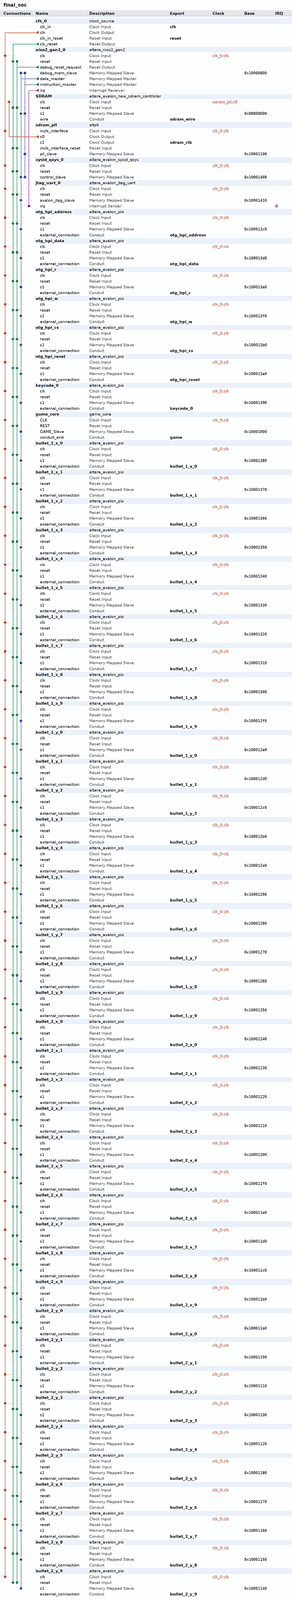
[diagram p0: system contents, whole]
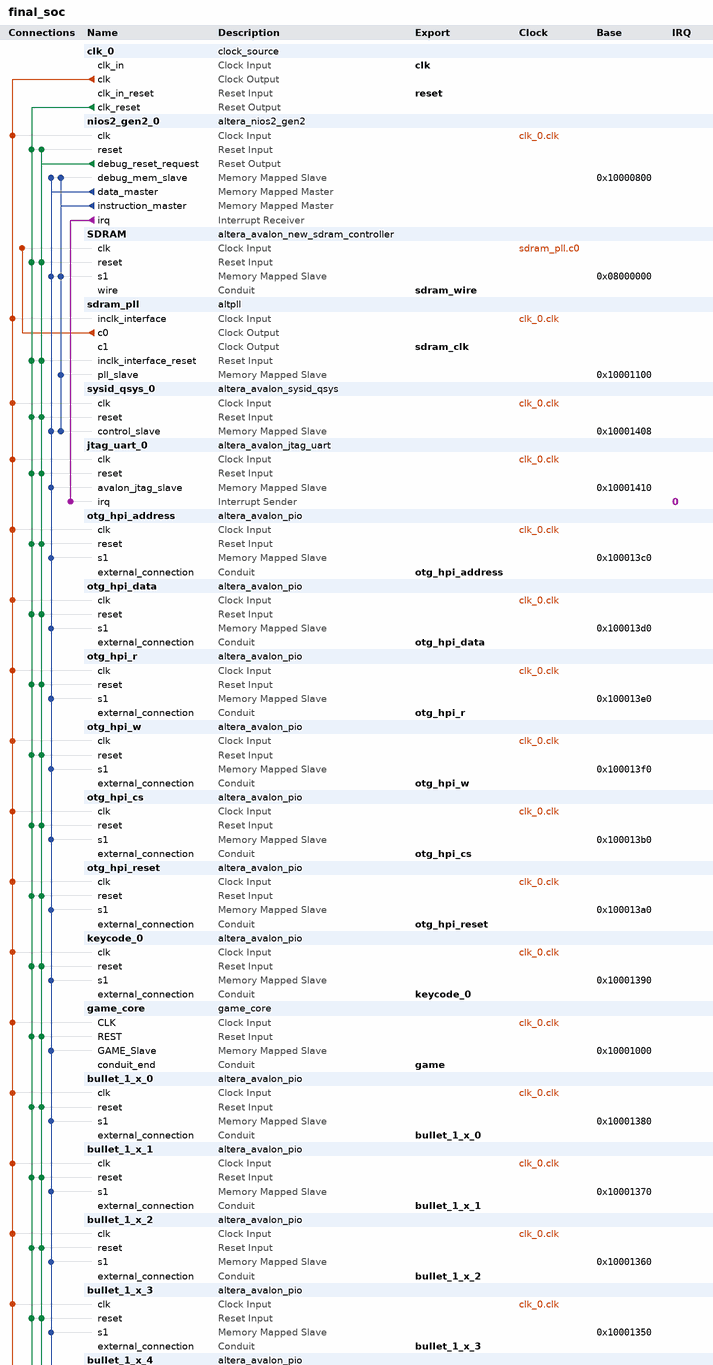
[diagram p1: system contents, upper part]
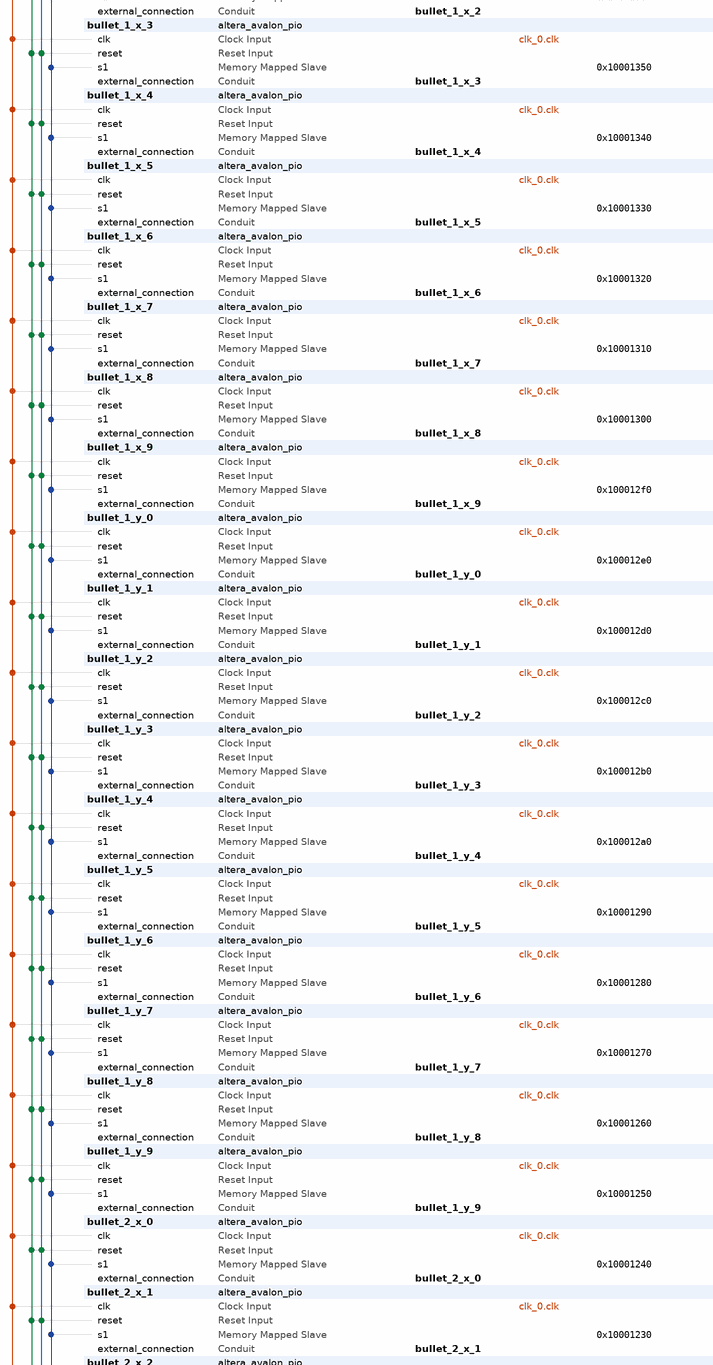
[diagram p2: system contents, middle part]
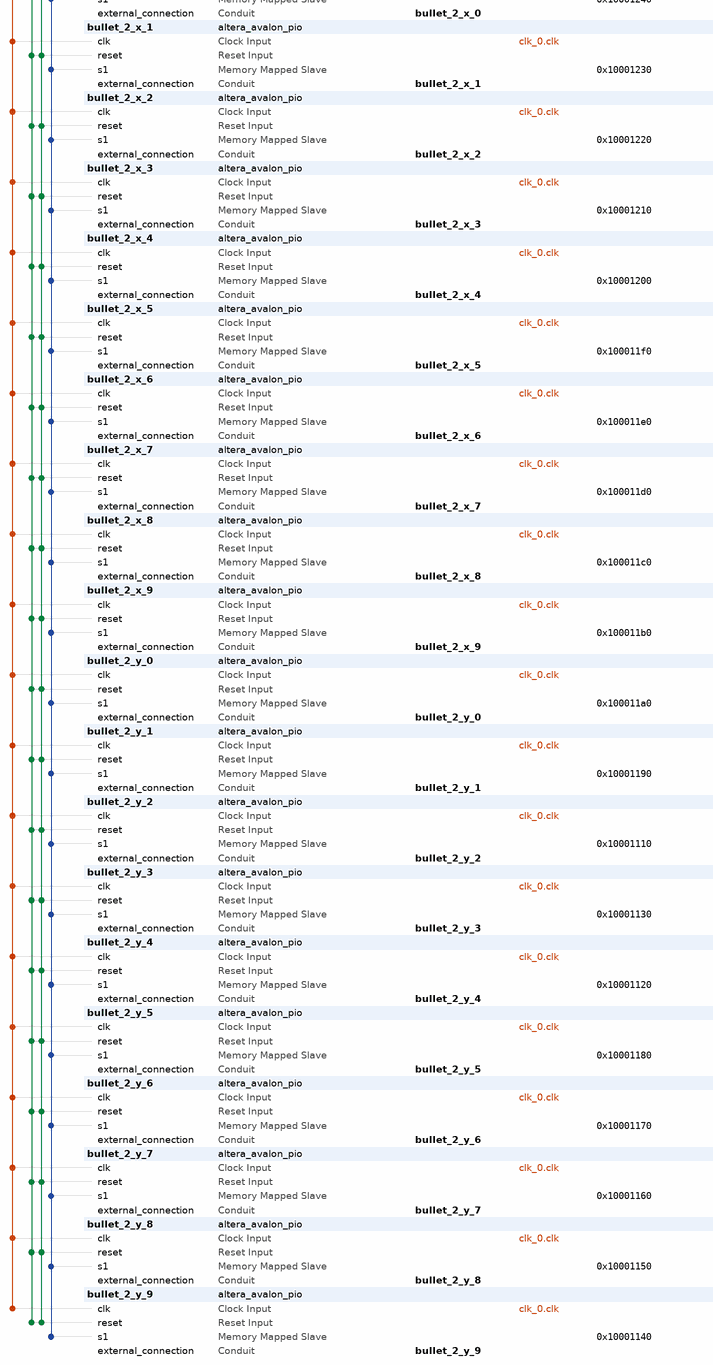
[diagram p3: system contents, lower part]
# Platform Designer (Qsys) system final_soc, Cyclone IV E EP4CE115F29C7
# Parameters at their usual value, and those the tool derives, are not listed.
package require -exact qsys 18.0
create_system final_soc
set_project_property DEVICE_FAMILY {Cyclone IV E}
set_project_property DEVICE EP4CE115F29C7

add_instance clk_0 clock_source 18.0
set_instance_parameter_value clk_0 clockFrequency 50000000

add_instance nios2_gen2_0 altera_nios2_gen2 18.0
set_instance_parameter_value nios2_gen2_0 dcache_size 2048
set_instance_parameter_value nios2_gen2_0 exceptionSlave SDRAM.s1
set_instance_parameter_value nios2_gen2_0 icache_size 4096
set_instance_parameter_value nios2_gen2_0 impl Tiny
set_instance_parameter_value nios2_gen2_0 resetSlave SDRAM.s1

add_instance SDRAM altera_avalon_new_sdram_controller 18.0
set_instance_parameter_value SDRAM TAC 5.5
set_instance_parameter_value SDRAM TRCD 20.0
set_instance_parameter_value SDRAM TRP 20.0
set_instance_parameter_value SDRAM casLatency 3
set_instance_parameter_value SDRAM columnWidth 10
set_instance_parameter_value SDRAM dataWidth 32
set_instance_parameter_value SDRAM generateSimulationModel false
set_instance_parameter_value SDRAM model single_Micron_MT48LC4M32B2_7_chip
set_instance_parameter_value SDRAM numberOfBanks 4
set_instance_parameter_value SDRAM numberOfChipSelects 1
set_instance_parameter_value SDRAM powerUpDelay 100.0
set_instance_parameter_value SDRAM refreshPeriod 7.8125
set_instance_parameter_value SDRAM rowWidth 13

add_instance sdram_pll altpll 18.0
set_instance_parameter_value sdram_pll CLK0_DIVIDE_BY 1
set_instance_parameter_value sdram_pll CLK0_MULTIPLY_BY 1
set_instance_parameter_value sdram_pll CLK1_DIVIDE_BY 1
set_instance_parameter_value sdram_pll CLK1_DUTY_CYCLE 50
set_instance_parameter_value sdram_pll CLK1_MULTIPLY_BY 1
set_instance_parameter_value sdram_pll CLK1_PHASE_SHIFT -3000
set_instance_parameter_value sdram_pll INCLK0_INPUT_FREQUENCY 20000
set_instance_parameter_value sdram_pll PORT_ARESET PORT_UNUSED
set_instance_parameter_value sdram_pll PORT_LOCKED PORT_UNUSED
set_instance_parameter_value sdram_pll PORT_clk1 PORT_USED
set_instance_parameter_value sdram_pll PORT_clk2 PORT_UNUSED
set_instance_parameter_value sdram_pll PORT_clk3 PORT_UNUSED

add_instance sysid_qsys_0 altera_avalon_sysid_qsys 18.0
set_instance_parameter_value sysid_qsys_0 id 0

add_instance jtag_uart_0 altera_avalon_jtag_uart 18.0
set_instance_parameter_value jtag_uart_0 simInteractiveOptions NO_INTERACTIVE_WINDOWS

add_instance otg_hpi_address altera_avalon_pio 18.0
set_instance_parameter_value otg_hpi_address direction Output
set_instance_parameter_value otg_hpi_address width 2

add_instance otg_hpi_data altera_avalon_pio 18.0
set_instance_parameter_value otg_hpi_data direction InOut
set_instance_parameter_value otg_hpi_data width 16

add_instance otg_hpi_r altera_avalon_pio 18.0
set_instance_parameter_value otg_hpi_r direction Output
set_instance_parameter_value otg_hpi_r width 1

add_instance otg_hpi_w altera_avalon_pio 18.0
set_instance_parameter_value otg_hpi_w direction Output
set_instance_parameter_value otg_hpi_w width 1

add_instance otg_hpi_cs altera_avalon_pio 18.0
set_instance_parameter_value otg_hpi_cs direction Output
set_instance_parameter_value otg_hpi_cs width 1

add_instance otg_hpi_reset altera_avalon_pio 18.0
set_instance_parameter_value otg_hpi_reset direction Output
set_instance_parameter_value otg_hpi_reset width 1

add_instance keycode_0 altera_avalon_pio 18.0
set_instance_parameter_value keycode_0 direction Output
set_instance_parameter_value keycode_0 width 8

add_instance game_core game_core 1.0

add_instance bullet_1_x_0 altera_avalon_pio 18.0
set_instance_parameter_value bullet_1_x_0 direction Output
set_instance_parameter_value bullet_1_x_0 width 10

add_instance bullet_1_x_1 altera_avalon_pio 18.0
set_instance_parameter_value bullet_1_x_1 direction Output
set_instance_parameter_value bullet_1_x_1 width 10

add_instance bullet_1_x_2 altera_avalon_pio 18.0
set_instance_parameter_value bullet_1_x_2 direction Output
set_instance_parameter_value bullet_1_x_2 width 10

add_instance bullet_1_x_3 altera_avalon_pio 18.0
set_instance_parameter_value bullet_1_x_3 direction Output
set_instance_parameter_value bullet_1_x_3 width 10

add_instance bullet_1_x_4 altera_avalon_pio 18.0
set_instance_parameter_value bullet_1_x_4 direction Output
set_instance_parameter_value bullet_1_x_4 width 10

add_instance bullet_1_x_5 altera_avalon_pio 18.0
set_instance_parameter_value bullet_1_x_5 direction Output
set_instance_parameter_value bullet_1_x_5 width 10

add_instance bullet_1_x_6 altera_avalon_pio 18.0
set_instance_parameter_value bullet_1_x_6 direction Output
set_instance_parameter_value bullet_1_x_6 width 10

add_instance bullet_1_x_7 altera_avalon_pio 18.0
set_instance_parameter_value bullet_1_x_7 direction Output
set_instance_parameter_value bullet_1_x_7 width 10

add_instance bullet_1_x_8 altera_avalon_pio 18.0
set_instance_parameter_value bullet_1_x_8 direction Output
set_instance_parameter_value bullet_1_x_8 width 10

add_instance bullet_1_x_9 altera_avalon_pio 18.0
set_instance_parameter_value bullet_1_x_9 direction Output
set_instance_parameter_value bullet_1_x_9 width 10

add_instance bullet_1_y_0 altera_avalon_pio 18.0
set_instance_parameter_value bullet_1_y_0 direction Output
set_instance_parameter_value bullet_1_y_0 width 10

add_instance bullet_1_y_1 altera_avalon_pio 18.0
set_instance_parameter_value bullet_1_y_1 direction Output
set_instance_parameter_value bullet_1_y_1 width 10

add_instance bullet_1_y_2 altera_avalon_pio 18.0
set_instance_parameter_value bullet_1_y_2 direction Output
set_instance_parameter_value bullet_1_y_2 width 10

add_instance bullet_1_y_3 altera_avalon_pio 18.0
set_instance_parameter_value bullet_1_y_3 direction Output
set_instance_parameter_value bullet_1_y_3 width 10

add_instance bullet_1_y_4 altera_avalon_pio 18.0
set_instance_parameter_value bullet_1_y_4 direction Output
set_instance_parameter_value bullet_1_y_4 width 10

add_instance bullet_1_y_5 altera_avalon_pio 18.0
set_instance_parameter_value bullet_1_y_5 direction Output
set_instance_parameter_value bullet_1_y_5 width 10

add_instance bullet_1_y_6 altera_avalon_pio 18.0
set_instance_parameter_value bullet_1_y_6 direction Output
set_instance_parameter_value bullet_1_y_6 width 10

add_instance bullet_1_y_7 altera_avalon_pio 18.0
set_instance_parameter_value bullet_1_y_7 direction Output
set_instance_parameter_value bullet_1_y_7 width 10

add_instance bullet_1_y_8 altera_avalon_pio 18.0
set_instance_parameter_value bullet_1_y_8 direction Output
set_instance_parameter_value bullet_1_y_8 width 10

add_instance bullet_1_y_9 altera_avalon_pio 18.0
set_instance_parameter_value bullet_1_y_9 direction Output
set_instance_parameter_value bullet_1_y_9 width 10

add_instance bullet_2_x_0 altera_avalon_pio 18.0
set_instance_parameter_value bullet_2_x_0 direction Output
set_instance_parameter_value bullet_2_x_0 width 10

add_instance bullet_2_x_1 altera_avalon_pio 18.0
set_instance_parameter_value bullet_2_x_1 direction Output
set_instance_parameter_value bullet_2_x_1 width 10

add_instance bullet_2_x_2 altera_avalon_pio 18.0
set_instance_parameter_value bullet_2_x_2 direction Output
set_instance_parameter_value bullet_2_x_2 width 10

add_instance bullet_2_x_3 altera_avalon_pio 18.0
set_instance_parameter_value bullet_2_x_3 direction Output
set_instance_parameter_value bullet_2_x_3 width 10

add_instance bullet_2_x_4 altera_avalon_pio 18.0
set_instance_parameter_value bullet_2_x_4 direction Output
set_instance_parameter_value bullet_2_x_4 width 10

add_instance bullet_2_x_5 altera_avalon_pio 18.0
set_instance_parameter_value bullet_2_x_5 direction Output
set_instance_parameter_value bullet_2_x_5 width 10

add_instance bullet_2_x_6 altera_avalon_pio 18.0
set_instance_parameter_value bullet_2_x_6 direction Output
set_instance_parameter_value bullet_2_x_6 width 10

add_instance bullet_2_x_7 altera_avalon_pio 18.0
set_instance_parameter_value bullet_2_x_7 direction Output
set_instance_parameter_value bullet_2_x_7 width 10

add_instance bullet_2_x_8 altera_avalon_pio 18.0
set_instance_parameter_value bullet_2_x_8 direction Output
set_instance_parameter_value bullet_2_x_8 width 10

add_instance bullet_2_x_9 altera_avalon_pio 18.0
set_instance_parameter_value bullet_2_x_9 direction Output
set_instance_parameter_value bullet_2_x_9 width 10

add_instance bullet_2_y_0 altera_avalon_pio 18.0
set_instance_parameter_value bullet_2_y_0 direction Output
set_instance_parameter_value bullet_2_y_0 width 10

add_instance bullet_2_y_1 altera_avalon_pio 18.0
set_instance_parameter_value bullet_2_y_1 direction Output
set_instance_parameter_value bullet_2_y_1 width 10

add_instance bullet_2_y_2 altera_avalon_pio 18.0
set_instance_parameter_value bullet_2_y_2 direction Output
set_instance_parameter_value bullet_2_y_2 width 10

add_instance bullet_2_y_3 altera_avalon_pio 18.0
set_instance_parameter_value bullet_2_y_3 direction Output
set_instance_parameter_value bullet_2_y_3 width 10

add_instance bullet_2_y_4 altera_avalon_pio 18.0
set_instance_parameter_value bullet_2_y_4 direction Output
set_instance_parameter_value bullet_2_y_4 width 10

add_instance bullet_2_y_5 altera_avalon_pio 18.0
set_instance_parameter_value bullet_2_y_5 direction Output
set_instance_parameter_value bullet_2_y_5 width 10

add_instance bullet_2_y_6 altera_avalon_pio 18.0
set_instance_parameter_value bullet_2_y_6 direction Output
set_instance_parameter_value bullet_2_y_6 width 10

add_instance bullet_2_y_7 altera_avalon_pio 18.0
set_instance_parameter_value bullet_2_y_7 direction Output
set_instance_parameter_value bullet_2_y_7 width 10

add_instance bullet_2_y_8 altera_avalon_pio 18.0
set_instance_parameter_value bullet_2_y_8 direction Output
set_instance_parameter_value bullet_2_y_8 width 10

add_instance bullet_2_y_9 altera_avalon_pio 18.0
set_instance_parameter_value bullet_2_y_9 direction Output
set_instance_parameter_value bullet_2_y_9 width 10

# connections
add_connection clk_0.clk bullet_1_x_0.clk clock
add_connection clk_0.clk bullet_1_x_1.clk clock
add_connection clk_0.clk bullet_1_x_2.clk clock
add_connection clk_0.clk bullet_1_x_3.clk clock
add_connection clk_0.clk bullet_1_x_4.clk clock
add_connection clk_0.clk bullet_1_x_5.clk clock
add_connection clk_0.clk bullet_1_x_6.clk clock
add_connection clk_0.clk bullet_1_x_7.clk clock
add_connection clk_0.clk bullet_1_x_8.clk clock
add_connection clk_0.clk bullet_1_x_9.clk clock
add_connection clk_0.clk bullet_1_y_0.clk clock
add_connection clk_0.clk bullet_1_y_1.clk clock
add_connection clk_0.clk bullet_1_y_2.clk clock
add_connection clk_0.clk bullet_1_y_3.clk clock
add_connection clk_0.clk bullet_1_y_4.clk clock
add_connection clk_0.clk bullet_1_y_5.clk clock
add_connection clk_0.clk bullet_1_y_6.clk clock
add_connection clk_0.clk bullet_1_y_7.clk clock
add_connection clk_0.clk bullet_1_y_8.clk clock
add_connection clk_0.clk bullet_1_y_9.clk clock
add_connection clk_0.clk bullet_2_x_0.clk clock
add_connection clk_0.clk bullet_2_x_1.clk clock
add_connection clk_0.clk bullet_2_x_2.clk clock
add_connection clk_0.clk bullet_2_x_3.clk clock
add_connection clk_0.clk bullet_2_x_4.clk clock
add_connection clk_0.clk bullet_2_x_5.clk clock
add_connection clk_0.clk bullet_2_x_6.clk clock
add_connection clk_0.clk bullet_2_x_7.clk clock
add_connection clk_0.clk bullet_2_x_8.clk clock
add_connection clk_0.clk bullet_2_x_9.clk clock
add_connection clk_0.clk bullet_2_y_0.clk clock
add_connection clk_0.clk bullet_2_y_1.clk clock
add_connection clk_0.clk bullet_2_y_2.clk clock
add_connection clk_0.clk bullet_2_y_3.clk clock
add_connection clk_0.clk bullet_2_y_4.clk clock
add_connection clk_0.clk bullet_2_y_5.clk clock
add_connection clk_0.clk bullet_2_y_6.clk clock
add_connection clk_0.clk bullet_2_y_7.clk clock
add_connection clk_0.clk bullet_2_y_8.clk clock
add_connection clk_0.clk bullet_2_y_9.clk clock
add_connection clk_0.clk game_core.CLK clock
add_connection clk_0.clk jtag_uart_0.clk clock
add_connection clk_0.clk keycode_0.clk clock
add_connection clk_0.clk nios2_gen2_0.clk clock
add_connection clk_0.clk otg_hpi_address.clk clock
add_connection clk_0.clk otg_hpi_cs.clk clock
add_connection clk_0.clk otg_hpi_data.clk clock
add_connection clk_0.clk otg_hpi_r.clk clock
add_connection clk_0.clk otg_hpi_reset.clk clock
add_connection clk_0.clk otg_hpi_w.clk clock
add_connection clk_0.clk sdram_pll.inclk_interface clock
add_connection clk_0.clk sysid_qsys_0.clk clock
add_connection sdram_pll.c0 SDRAM.clk clock
add_connection clk_0.clk_reset bullet_1_x_0.reset reset
add_connection clk_0.clk_reset bullet_1_x_1.reset reset
add_connection clk_0.clk_reset bullet_1_x_2.reset reset
add_connection clk_0.clk_reset bullet_1_x_3.reset reset
add_connection clk_0.clk_reset bullet_1_x_4.reset reset
add_connection clk_0.clk_reset bullet_1_x_5.reset reset
add_connection clk_0.clk_reset bullet_1_x_6.reset reset
add_connection clk_0.clk_reset bullet_1_x_7.reset reset
add_connection clk_0.clk_reset bullet_1_x_8.reset reset
add_connection clk_0.clk_reset bullet_1_x_9.reset reset
add_connection clk_0.clk_reset bullet_1_y_0.reset reset
add_connection clk_0.clk_reset bullet_1_y_1.reset reset
add_connection clk_0.clk_reset bullet_1_y_2.reset reset
add_connection clk_0.clk_reset bullet_1_y_3.reset reset
add_connection clk_0.clk_reset bullet_1_y_4.reset reset
add_connection clk_0.clk_reset bullet_1_y_5.reset reset
add_connection clk_0.clk_reset bullet_1_y_6.reset reset
add_connection clk_0.clk_reset bullet_1_y_7.reset reset
add_connection clk_0.clk_reset bullet_1_y_8.reset reset
add_connection clk_0.clk_reset bullet_1_y_9.reset reset
add_connection clk_0.clk_reset bullet_2_x_0.reset reset
add_connection clk_0.clk_reset bullet_2_x_1.reset reset
add_connection clk_0.clk_reset bullet_2_x_2.reset reset
add_connection clk_0.clk_reset bullet_2_x_3.reset reset
add_connection clk_0.clk_reset bullet_2_x_4.reset reset
add_connection clk_0.clk_reset bullet_2_x_5.reset reset
add_connection clk_0.clk_reset bullet_2_x_6.reset reset
add_connection clk_0.clk_reset bullet_2_x_7.reset reset
add_connection clk_0.clk_reset bullet_2_x_8.reset reset
add_connection clk_0.clk_reset bullet_2_x_9.reset reset
add_connection clk_0.clk_reset bullet_2_y_0.reset reset
add_connection clk_0.clk_reset bullet_2_y_1.reset reset
add_connection clk_0.clk_reset bullet_2_y_2.reset reset
add_connection clk_0.clk_reset bullet_2_y_3.reset reset
add_connection clk_0.clk_reset bullet_2_y_4.reset reset
add_connection clk_0.clk_reset bullet_2_y_5.reset reset
add_connection clk_0.clk_reset bullet_2_y_6.reset reset
add_connection clk_0.clk_reset bullet_2_y_7.reset reset
add_connection clk_0.clk_reset bullet_2_y_8.reset reset
add_connection clk_0.clk_reset bullet_2_y_9.reset reset
add_connection clk_0.clk_reset game_core.REST reset
add_connection clk_0.clk_reset jtag_uart_0.reset reset
add_connection clk_0.clk_reset keycode_0.reset reset
add_connection clk_0.clk_reset nios2_gen2_0.reset reset
add_connection clk_0.clk_reset otg_hpi_address.reset reset
add_connection clk_0.clk_reset otg_hpi_cs.reset reset
add_connection clk_0.clk_reset otg_hpi_data.reset reset
add_connection clk_0.clk_reset otg_hpi_r.reset reset
add_connection clk_0.clk_reset otg_hpi_reset.reset reset
add_connection clk_0.clk_reset otg_hpi_w.reset reset
add_connection clk_0.clk_reset SDRAM.reset reset
add_connection clk_0.clk_reset sdram_pll.inclk_interface_reset reset
add_connection clk_0.clk_reset sysid_qsys_0.reset reset
add_connection nios2_gen2_0.debug_reset_request bullet_1_x_0.reset reset
add_connection nios2_gen2_0.debug_reset_request bullet_1_x_1.reset reset
add_connection nios2_gen2_0.debug_reset_request bullet_1_x_2.reset reset
add_connection nios2_gen2_0.debug_reset_request bullet_1_x_3.reset reset
add_connection nios2_gen2_0.debug_reset_request bullet_1_x_4.reset reset
add_connection nios2_gen2_0.debug_reset_request bullet_1_x_5.reset reset
add_connection nios2_gen2_0.debug_reset_request bullet_1_x_6.reset reset
add_connection nios2_gen2_0.debug_reset_request bullet_1_x_7.reset reset
add_connection nios2_gen2_0.debug_reset_request bullet_1_x_8.reset reset
add_connection nios2_gen2_0.debug_reset_request bullet_1_x_9.reset reset
add_connection nios2_gen2_0.debug_reset_request bullet_1_y_0.reset reset
add_connection nios2_gen2_0.debug_reset_request bullet_1_y_1.reset reset
add_connection nios2_gen2_0.debug_reset_request bullet_1_y_2.reset reset
add_connection nios2_gen2_0.debug_reset_request bullet_1_y_3.reset reset
add_connection nios2_gen2_0.debug_reset_request bullet_1_y_4.reset reset
add_connection nios2_gen2_0.debug_reset_request bullet_1_y_5.reset reset
add_connection nios2_gen2_0.debug_reset_request bullet_1_y_6.reset reset
add_connection nios2_gen2_0.debug_reset_request bullet_1_y_7.reset reset
add_connection nios2_gen2_0.debug_reset_request bullet_1_y_8.reset reset
add_connection nios2_gen2_0.debug_reset_request bullet_1_y_9.reset reset
add_connection nios2_gen2_0.debug_reset_request bullet_2_x_0.reset reset
add_connection nios2_gen2_0.debug_reset_request bullet_2_x_1.reset reset
add_connection nios2_gen2_0.debug_reset_request bullet_2_x_2.reset reset
add_connection nios2_gen2_0.debug_reset_request bullet_2_x_3.reset reset
add_connection nios2_gen2_0.debug_reset_request bullet_2_x_4.reset reset
add_connection nios2_gen2_0.debug_reset_request bullet_2_x_5.reset reset
add_connection nios2_gen2_0.debug_reset_request bullet_2_x_6.reset reset
add_connection nios2_gen2_0.debug_reset_request bullet_2_x_7.reset reset
add_connection nios2_gen2_0.debug_reset_request bullet_2_x_8.reset reset
add_connection nios2_gen2_0.debug_reset_request bullet_2_x_9.reset reset
add_connection nios2_gen2_0.debug_reset_request bullet_2_y_0.reset reset
add_connection nios2_gen2_0.debug_reset_request bullet_2_y_1.reset reset
add_connection nios2_gen2_0.debug_reset_request bullet_2_y_2.reset reset
add_connection nios2_gen2_0.debug_reset_request bullet_2_y_3.reset reset
add_connection nios2_gen2_0.debug_reset_request bullet_2_y_4.reset reset
add_connection nios2_gen2_0.debug_reset_request bullet_2_y_5.reset reset
add_connection nios2_gen2_0.debug_reset_request bullet_2_y_6.reset reset
add_connection nios2_gen2_0.debug_reset_request bullet_2_y_7.reset reset
add_connection nios2_gen2_0.debug_reset_request bullet_2_y_8.reset reset
add_connection nios2_gen2_0.debug_reset_request bullet_2_y_9.reset reset
add_connection nios2_gen2_0.debug_reset_request game_core.REST reset
add_connection nios2_gen2_0.debug_reset_request jtag_uart_0.reset reset
add_connection nios2_gen2_0.debug_reset_request keycode_0.reset reset
add_connection nios2_gen2_0.debug_reset_request nios2_gen2_0.reset reset
add_connection nios2_gen2_0.debug_reset_request otg_hpi_address.reset reset
add_connection nios2_gen2_0.debug_reset_request otg_hpi_cs.reset reset
add_connection nios2_gen2_0.debug_reset_request otg_hpi_data.reset reset
add_connection nios2_gen2_0.debug_reset_request otg_hpi_r.reset reset
add_connection nios2_gen2_0.debug_reset_request otg_hpi_reset.reset reset
add_connection nios2_gen2_0.debug_reset_request otg_hpi_w.reset reset
add_connection nios2_gen2_0.debug_reset_request SDRAM.reset reset
add_connection nios2_gen2_0.debug_reset_request sdram_pll.inclk_interface_reset reset
add_connection nios2_gen2_0.debug_reset_request sysid_qsys_0.reset reset
add_connection nios2_gen2_0.data_master bullet_1_x_0.s1 avalon
set_connection_parameter_value nios2_gen2_0.data_master/bullet_1_x_0.s1 baseAddress 0x10001380
add_connection nios2_gen2_0.data_master bullet_1_x_1.s1 avalon
set_connection_parameter_value nios2_gen2_0.data_master/bullet_1_x_1.s1 baseAddress 0x10001370
add_connection nios2_gen2_0.data_master bullet_1_x_2.s1 avalon
set_connection_parameter_value nios2_gen2_0.data_master/bullet_1_x_2.s1 baseAddress 0x10001360
add_connection nios2_gen2_0.data_master bullet_1_x_3.s1 avalon
set_connection_parameter_value nios2_gen2_0.data_master/bullet_1_x_3.s1 baseAddress 0x10001350
add_connection nios2_gen2_0.data_master bullet_1_x_4.s1 avalon
set_connection_parameter_value nios2_gen2_0.data_master/bullet_1_x_4.s1 baseAddress 0x10001340
add_connection nios2_gen2_0.data_master bullet_1_x_5.s1 avalon
set_connection_parameter_value nios2_gen2_0.data_master/bullet_1_x_5.s1 baseAddress 0x10001330
add_connection nios2_gen2_0.data_master bullet_1_x_6.s1 avalon
set_connection_parameter_value nios2_gen2_0.data_master/bullet_1_x_6.s1 baseAddress 0x10001320
add_connection nios2_gen2_0.data_master bullet_1_x_7.s1 avalon
set_connection_parameter_value nios2_gen2_0.data_master/bullet_1_x_7.s1 baseAddress 0x10001310
add_connection nios2_gen2_0.data_master bullet_1_x_8.s1 avalon
set_connection_parameter_value nios2_gen2_0.data_master/bullet_1_x_8.s1 baseAddress 0x10001300
add_connection nios2_gen2_0.data_master bullet_1_x_9.s1 avalon
set_connection_parameter_value nios2_gen2_0.data_master/bullet_1_x_9.s1 baseAddress 0x100012f0
add_connection nios2_gen2_0.data_master bullet_1_y_0.s1 avalon
set_connection_parameter_value nios2_gen2_0.data_master/bullet_1_y_0.s1 baseAddress 0x100012e0
add_connection nios2_gen2_0.data_master bullet_1_y_1.s1 avalon
set_connection_parameter_value nios2_gen2_0.data_master/bullet_1_y_1.s1 baseAddress 0x100012d0
add_connection nios2_gen2_0.data_master bullet_1_y_2.s1 avalon
set_connection_parameter_value nios2_gen2_0.data_master/bullet_1_y_2.s1 baseAddress 0x100012c0
add_connection nios2_gen2_0.data_master bullet_1_y_3.s1 avalon
set_connection_parameter_value nios2_gen2_0.data_master/bullet_1_y_3.s1 baseAddress 0x100012b0
add_connection nios2_gen2_0.data_master bullet_1_y_4.s1 avalon
set_connection_parameter_value nios2_gen2_0.data_master/bullet_1_y_4.s1 baseAddress 0x100012a0
add_connection nios2_gen2_0.data_master bullet_1_y_5.s1 avalon
set_connection_parameter_value nios2_gen2_0.data_master/bullet_1_y_5.s1 baseAddress 0x10001290
add_connection nios2_gen2_0.data_master bullet_1_y_6.s1 avalon
set_connection_parameter_value nios2_gen2_0.data_master/bullet_1_y_6.s1 baseAddress 0x10001280
add_connection nios2_gen2_0.data_master bullet_1_y_7.s1 avalon
set_connection_parameter_value nios2_gen2_0.data_master/bullet_1_y_7.s1 baseAddress 0x10001270
add_connection nios2_gen2_0.data_master bullet_1_y_8.s1 avalon
set_connection_parameter_value nios2_gen2_0.data_master/bullet_1_y_8.s1 baseAddress 0x10001260
add_connection nios2_gen2_0.data_master bullet_1_y_9.s1 avalon
set_connection_parameter_value nios2_gen2_0.data_master/bullet_1_y_9.s1 baseAddress 0x10001250
add_connection nios2_gen2_0.data_master bullet_2_x_0.s1 avalon
set_connection_parameter_value nios2_gen2_0.data_master/bullet_2_x_0.s1 baseAddress 0x10001240
add_connection nios2_gen2_0.data_master bullet_2_x_1.s1 avalon
set_connection_parameter_value nios2_gen2_0.data_master/bullet_2_x_1.s1 baseAddress 0x10001230
add_connection nios2_gen2_0.data_master bullet_2_x_2.s1 avalon
set_connection_parameter_value nios2_gen2_0.data_master/bullet_2_x_2.s1 baseAddress 0x10001220
add_connection nios2_gen2_0.data_master bullet_2_x_3.s1 avalon
set_connection_parameter_value nios2_gen2_0.data_master/bullet_2_x_3.s1 baseAddress 0x10001210
add_connection nios2_gen2_0.data_master bullet_2_x_4.s1 avalon
set_connection_parameter_value nios2_gen2_0.data_master/bullet_2_x_4.s1 baseAddress 0x10001200
add_connection nios2_gen2_0.data_master bullet_2_x_5.s1 avalon
set_connection_parameter_value nios2_gen2_0.data_master/bullet_2_x_5.s1 baseAddress 0x100011f0
add_connection nios2_gen2_0.data_master bullet_2_x_6.s1 avalon
set_connection_parameter_value nios2_gen2_0.data_master/bullet_2_x_6.s1 baseAddress 0x100011e0
add_connection nios2_gen2_0.data_master bullet_2_x_7.s1 avalon
set_connection_parameter_value nios2_gen2_0.data_master/bullet_2_x_7.s1 baseAddress 0x100011d0
add_connection nios2_gen2_0.data_master bullet_2_x_8.s1 avalon
set_connection_parameter_value nios2_gen2_0.data_master/bullet_2_x_8.s1 baseAddress 0x100011c0
add_connection nios2_gen2_0.data_master bullet_2_x_9.s1 avalon
set_connection_parameter_value nios2_gen2_0.data_master/bullet_2_x_9.s1 baseAddress 0x100011b0
add_connection nios2_gen2_0.data_master bullet_2_y_0.s1 avalon
set_connection_parameter_value nios2_gen2_0.data_master/bullet_2_y_0.s1 baseAddress 0x100011a0
add_connection nios2_gen2_0.data_master bullet_2_y_1.s1 avalon
set_connection_parameter_value nios2_gen2_0.data_master/bullet_2_y_1.s1 baseAddress 0x10001190
add_connection nios2_gen2_0.data_master bullet_2_y_2.s1 avalon
set_connection_parameter_value nios2_gen2_0.data_master/bullet_2_y_2.s1 baseAddress 0x10001110
add_connection nios2_gen2_0.data_master bullet_2_y_3.s1 avalon
set_connection_parameter_value nios2_gen2_0.data_master/bullet_2_y_3.s1 baseAddress 0x10001130
add_connection nios2_gen2_0.data_master bullet_2_y_4.s1 avalon
set_connection_parameter_value nios2_gen2_0.data_master/bullet_2_y_4.s1 baseAddress 0x10001120
add_connection nios2_gen2_0.data_master bullet_2_y_5.s1 avalon
set_connection_parameter_value nios2_gen2_0.data_master/bullet_2_y_5.s1 baseAddress 0x10001180
add_connection nios2_gen2_0.data_master bullet_2_y_6.s1 avalon
set_connection_parameter_value nios2_gen2_0.data_master/bullet_2_y_6.s1 baseAddress 0x10001170
add_connection nios2_gen2_0.data_master bullet_2_y_7.s1 avalon
set_connection_parameter_value nios2_gen2_0.data_master/bullet_2_y_7.s1 baseAddress 0x10001160
add_connection nios2_gen2_0.data_master bullet_2_y_8.s1 avalon
set_connection_parameter_value nios2_gen2_0.data_master/bullet_2_y_8.s1 baseAddress 0x10001150
add_connection nios2_gen2_0.data_master bullet_2_y_9.s1 avalon
set_connection_parameter_value nios2_gen2_0.data_master/bullet_2_y_9.s1 baseAddress 0x10001140
add_connection nios2_gen2_0.data_master game_core.GAME_Slave avalon
set_connection_parameter_value nios2_gen2_0.data_master/game_core.GAME_Slave baseAddress 0x10001000
add_connection nios2_gen2_0.data_master jtag_uart_0.avalon_jtag_slave avalon
set_connection_parameter_value nios2_gen2_0.data_master/jtag_uart_0.avalon_jtag_slave baseAddress 0x10001410
add_connection nios2_gen2_0.data_master keycode_0.s1 avalon
set_connection_parameter_value nios2_gen2_0.data_master/keycode_0.s1 baseAddress 0x10001390
add_connection nios2_gen2_0.data_master nios2_gen2_0.debug_mem_slave avalon
set_connection_parameter_value nios2_gen2_0.data_master/nios2_gen2_0.debug_mem_slave baseAddress 0x10000800
add_connection nios2_gen2_0.data_master otg_hpi_address.s1 avalon
set_connection_parameter_value nios2_gen2_0.data_master/otg_hpi_address.s1 baseAddress 0x100013c0
add_connection nios2_gen2_0.data_master otg_hpi_cs.s1 avalon
set_connection_parameter_value nios2_gen2_0.data_master/otg_hpi_cs.s1 baseAddress 0x100013b0
add_connection nios2_gen2_0.data_master otg_hpi_data.s1 avalon
set_connection_parameter_value nios2_gen2_0.data_master/otg_hpi_data.s1 baseAddress 0x100013d0
add_connection nios2_gen2_0.data_master otg_hpi_r.s1 avalon
set_connection_parameter_value nios2_gen2_0.data_master/otg_hpi_r.s1 baseAddress 0x100013e0
add_connection nios2_gen2_0.data_master otg_hpi_reset.s1 avalon
set_connection_parameter_value nios2_gen2_0.data_master/otg_hpi_reset.s1 baseAddress 0x100013a0
add_connection nios2_gen2_0.data_master otg_hpi_w.s1 avalon
set_connection_parameter_value nios2_gen2_0.data_master/otg_hpi_w.s1 baseAddress 0x100013f0
add_connection nios2_gen2_0.data_master SDRAM.s1 avalon
set_connection_parameter_value nios2_gen2_0.data_master/SDRAM.s1 baseAddress 0x08000000
add_connection nios2_gen2_0.data_master sysid_qsys_0.control_slave avalon
set_connection_parameter_value nios2_gen2_0.data_master/sysid_qsys_0.control_slave baseAddress 0x10001408
add_connection nios2_gen2_0.instruction_master nios2_gen2_0.debug_mem_slave avalon
set_connection_parameter_value nios2_gen2_0.instruction_master/nios2_gen2_0.debug_mem_slave baseAddress 0x10000800
add_connection nios2_gen2_0.instruction_master SDRAM.s1 avalon
set_connection_parameter_value nios2_gen2_0.instruction_master/SDRAM.s1 baseAddress 0x08000000
add_connection nios2_gen2_0.instruction_master sdram_pll.pll_slave avalon
set_connection_parameter_value nios2_gen2_0.instruction_master/sdram_pll.pll_slave baseAddress 0x10001100
add_connection nios2_gen2_0.instruction_master sysid_qsys_0.control_slave avalon
set_connection_parameter_value nios2_gen2_0.instruction_master/sysid_qsys_0.control_slave baseAddress 0x10001408
add_connection nios2_gen2_0.irq jtag_uart_0.irq interrupt
set_connection_parameter_value nios2_gen2_0.irq/jtag_uart_0.irq irqNumber 0

# exported interfaces
add_interface bullet_1_x_0 conduit end
set_interface_property bullet_1_x_0 EXPORT_OF bullet_1_x_0.external_connection
add_interface bullet_1_x_1 conduit end
set_interface_property bullet_1_x_1 EXPORT_OF bullet_1_x_1.external_connection
add_interface bullet_1_x_2 conduit end
set_interface_property bullet_1_x_2 EXPORT_OF bullet_1_x_2.external_connection
add_interface bullet_1_x_3 conduit end
set_interface_property bullet_1_x_3 EXPORT_OF bullet_1_x_3.external_connection
add_interface bullet_1_x_4 conduit end
set_interface_property bullet_1_x_4 EXPORT_OF bullet_1_x_4.external_connection
add_interface bullet_1_x_5 conduit end
set_interface_property bullet_1_x_5 EXPORT_OF bullet_1_x_5.external_connection
add_interface bullet_1_x_6 conduit end
set_interface_property bullet_1_x_6 EXPORT_OF bullet_1_x_6.external_connection
add_interface bullet_1_x_7 conduit end
set_interface_property bullet_1_x_7 EXPORT_OF bullet_1_x_7.external_connection
add_interface bullet_1_x_8 conduit end
set_interface_property bullet_1_x_8 EXPORT_OF bullet_1_x_8.external_connection
add_interface bullet_1_x_9 conduit end
set_interface_property bullet_1_x_9 EXPORT_OF bullet_1_x_9.external_connection
add_interface bullet_1_y_0 conduit end
set_interface_property bullet_1_y_0 EXPORT_OF bullet_1_y_0.external_connection
add_interface bullet_1_y_1 conduit end
set_interface_property bullet_1_y_1 EXPORT_OF bullet_1_y_1.external_connection
add_interface bullet_1_y_2 conduit end
set_interface_property bullet_1_y_2 EXPORT_OF bullet_1_y_2.external_connection
add_interface bullet_1_y_3 conduit end
set_interface_property bullet_1_y_3 EXPORT_OF bullet_1_y_3.external_connection
add_interface bullet_1_y_4 conduit end
set_interface_property bullet_1_y_4 EXPORT_OF bullet_1_y_4.external_connection
add_interface bullet_1_y_5 conduit end
set_interface_property bullet_1_y_5 EXPORT_OF bullet_1_y_5.external_connection
add_interface bullet_1_y_6 conduit end
set_interface_property bullet_1_y_6 EXPORT_OF bullet_1_y_6.external_connection
add_interface bullet_1_y_7 conduit end
set_interface_property bullet_1_y_7 EXPORT_OF bullet_1_y_7.external_connection
add_interface bullet_1_y_8 conduit end
set_interface_property bullet_1_y_8 EXPORT_OF bullet_1_y_8.external_connection
add_interface bullet_1_y_9 conduit end
set_interface_property bullet_1_y_9 EXPORT_OF bullet_1_y_9.external_connection
add_interface bullet_2_x_0 conduit end
set_interface_property bullet_2_x_0 EXPORT_OF bullet_2_x_0.external_connection
add_interface bullet_2_x_1 conduit end
set_interface_property bullet_2_x_1 EXPORT_OF bullet_2_x_1.external_connection
add_interface bullet_2_x_2 conduit end
set_interface_property bullet_2_x_2 EXPORT_OF bullet_2_x_2.external_connection
add_interface bullet_2_x_3 conduit end
set_interface_property bullet_2_x_3 EXPORT_OF bullet_2_x_3.external_connection
add_interface bullet_2_x_4 conduit end
set_interface_property bullet_2_x_4 EXPORT_OF bullet_2_x_4.external_connection
add_interface bullet_2_x_5 conduit end
set_interface_property bullet_2_x_5 EXPORT_OF bullet_2_x_5.external_connection
add_interface bullet_2_x_6 conduit end
set_interface_property bullet_2_x_6 EXPORT_OF bullet_2_x_6.external_connection
add_interface bullet_2_x_7 conduit end
set_interface_property bullet_2_x_7 EXPORT_OF bullet_2_x_7.external_connection
add_interface bullet_2_x_8 conduit end
set_interface_property bullet_2_x_8 EXPORT_OF bullet_2_x_8.external_connection
add_interface bullet_2_x_9 conduit end
set_interface_property bullet_2_x_9 EXPORT_OF bullet_2_x_9.external_connection
add_interface bullet_2_y_0 conduit end
set_interface_property bullet_2_y_0 EXPORT_OF bullet_2_y_0.external_connection
add_interface bullet_2_y_1 conduit end
set_interface_property bullet_2_y_1 EXPORT_OF bullet_2_y_1.external_connection
add_interface bullet_2_y_2 conduit end
set_interface_property bullet_2_y_2 EXPORT_OF bullet_2_y_2.external_connection
add_interface bullet_2_y_3 conduit end
set_interface_property bullet_2_y_3 EXPORT_OF bullet_2_y_3.external_connection
add_interface bullet_2_y_4 conduit end
set_interface_property bullet_2_y_4 EXPORT_OF bullet_2_y_4.external_connection
add_interface bullet_2_y_5 conduit end
set_interface_property bullet_2_y_5 EXPORT_OF bullet_2_y_5.external_connection
add_interface bullet_2_y_6 conduit end
set_interface_property bullet_2_y_6 EXPORT_OF bullet_2_y_6.external_connection
add_interface bullet_2_y_7 conduit end
set_interface_property bullet_2_y_7 EXPORT_OF bullet_2_y_7.external_connection
add_interface bullet_2_y_8 conduit end
set_interface_property bullet_2_y_8 EXPORT_OF bullet_2_y_8.external_connection
add_interface bullet_2_y_9 conduit end
set_interface_property bullet_2_y_9 EXPORT_OF bullet_2_y_9.external_connection
add_interface clk clock sink
set_interface_property clk EXPORT_OF clk_0.clk_in
add_interface game conduit end
set_interface_property game EXPORT_OF game_core.conduit_end
add_interface keycode_0 conduit end
set_interface_property keycode_0 EXPORT_OF keycode_0.external_connection
add_interface otg_hpi_address conduit end
set_interface_property otg_hpi_address EXPORT_OF otg_hpi_address.external_connection
add_interface otg_hpi_cs conduit end
set_interface_property otg_hpi_cs EXPORT_OF otg_hpi_cs.external_connection
add_interface otg_hpi_data conduit end
set_interface_property otg_hpi_data EXPORT_OF otg_hpi_data.external_connection
add_interface otg_hpi_r conduit end
set_interface_property otg_hpi_r EXPORT_OF otg_hpi_r.external_connection
add_interface otg_hpi_reset conduit end
set_interface_property otg_hpi_reset EXPORT_OF otg_hpi_reset.external_connection
add_interface otg_hpi_w conduit end
set_interface_property otg_hpi_w EXPORT_OF otg_hpi_w.external_connection
add_interface reset reset sink
set_interface_property reset EXPORT_OF clk_0.clk_in_reset
add_interface sdram_clk clock source
set_interface_property sdram_clk EXPORT_OF sdram_pll.c1
add_interface sdram_wire conduit end
set_interface_property sdram_wire EXPORT_OF SDRAM.wire

set_interconnect_requirement {$system} qsys_mm.clockCrossingAdapter HANDSHAKE
set_interconnect_requirement {$system} qsys_mm.enableEccProtection FALSE
set_interconnect_requirement {$system} qsys_mm.insertDefaultSlave FALSE
set_interconnect_requirement {$system} qsys_mm.maxAdditionalLatency 1

save_system final_soc.qsys
